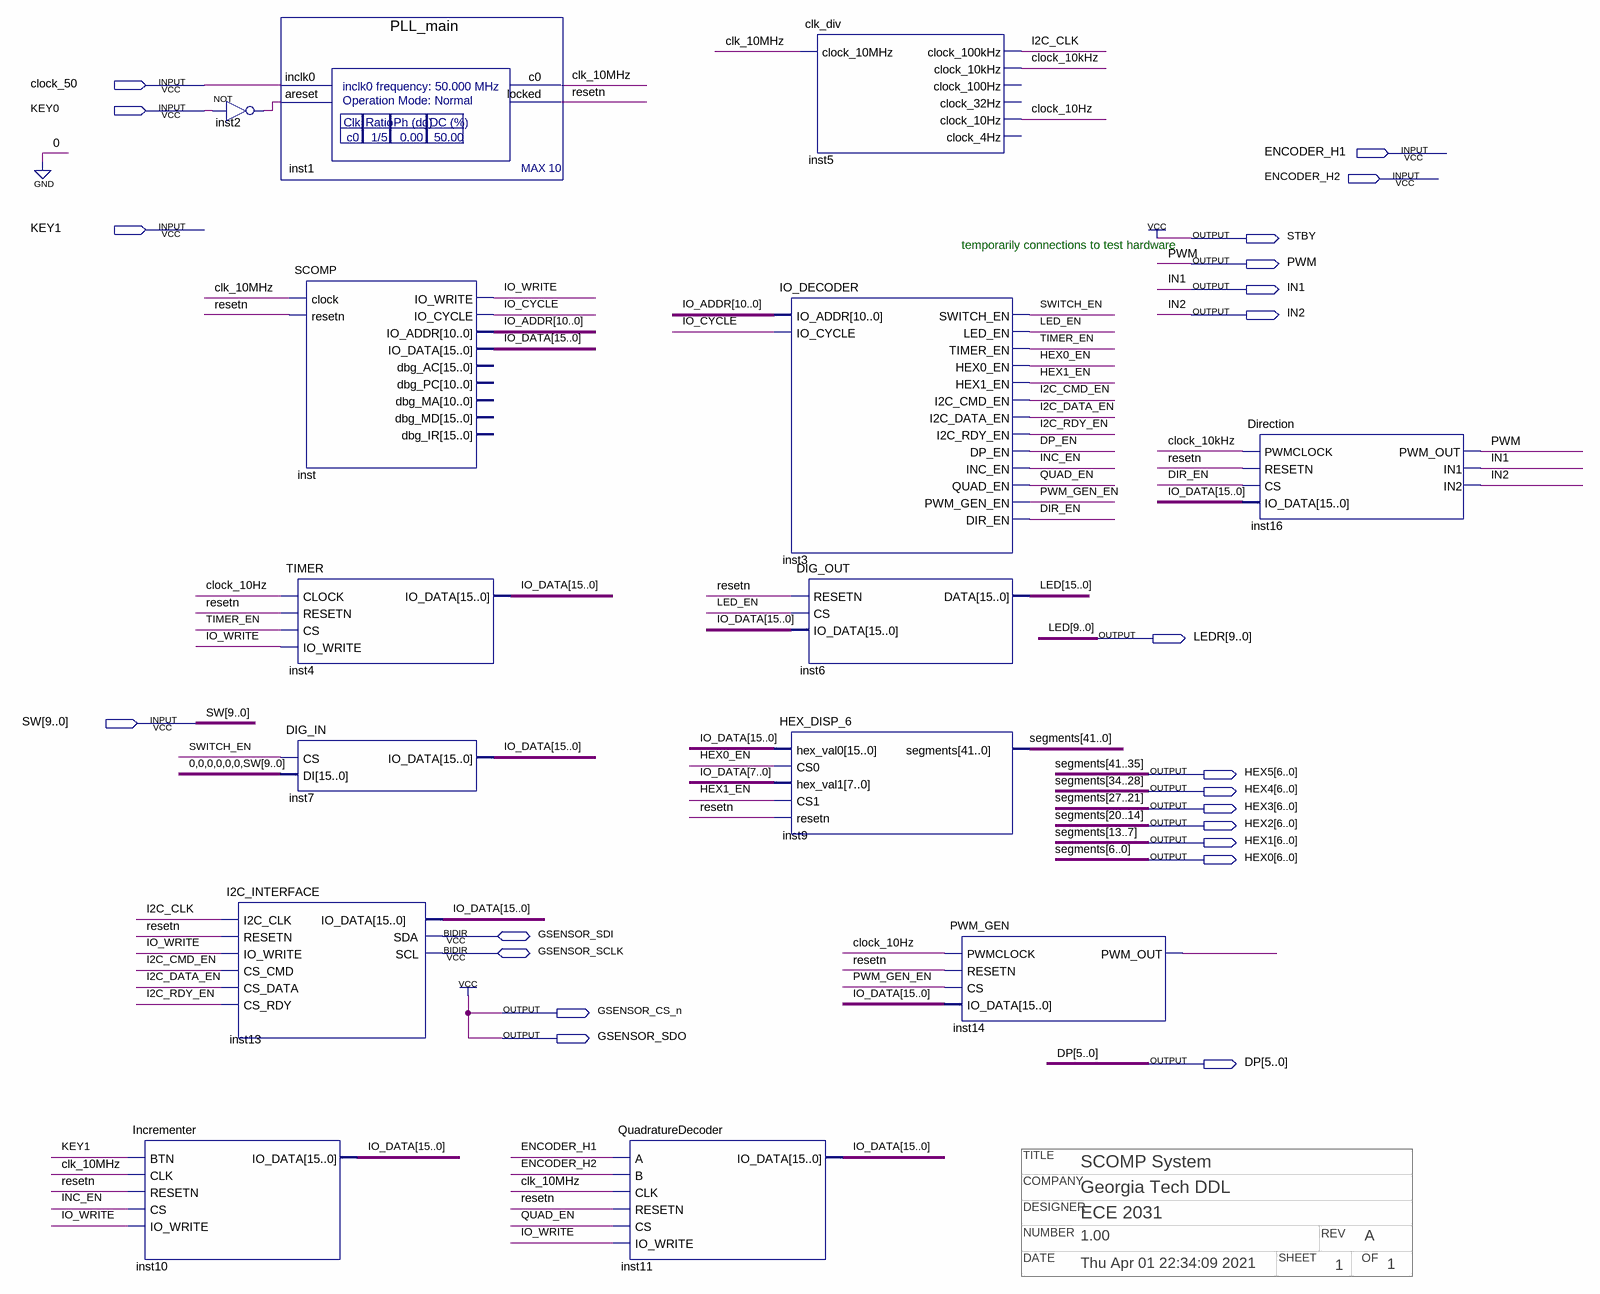
[diagram p0: schematic sheet]
// Quartus schematic SCOMP_System.bdf as structural Verilog: 14 symbols, 22 pins
// Title block: COMPANY: Georgia Tech DDL; DATE: Thu Apr 01 22:34:09 2021; DESIGNER: ECE 2031; NUMBER: 1.00; OF: 1; REV: A; SHEET: 1; TITLE: SCOMP System
module SCOMP_System (
  input  clock_50,
  input  KEY0,
  input  ENCODER_H1,
  input  ENCODER_H2,
  input  KEY1,
  input  [9:0] SW,
  inout  GSENSOR_SDI,
  inout  GSENSOR_SCLK,
  output STBY,
  output PWM,
  output IN1,
  output IN2,
  output [9:0] LEDR,
  output [6:0] HEX5,
  output [6:0] HEX4,
  output [6:0] HEX3,
  output [6:0] HEX2,
  output [6:0] HEX1,
  output [6:0] HEX0,
  output GSENSOR_CS_n,
  output GSENSOR_SDO,
  output [5:0] DP
);

  wire clk_10MHz, clock_10Hz, clock_10kHz, DIR_EN, DP_EN, HEX0_EN, HEX1_EN, I2C_CLK, I2C_CMD_EN, I2C_DATA_EN,
       I2C_RDY_EN, INC_EN, inst2_out, inst14_pwm_out, IO_CYCLE, IO_WRITE, LED_EN, PWM_GEN_EN, QUAD_EN,
       resetn, SWITCH_EN, TIMER_EN;
  wire [10:0] IO_ADDR;
  wire [15:0] IO_DATA;
  wire [15:10] LED;

  Incrementer inst10 (
    .BTN(KEY1), .CLK(clk_10MHz), .RESETN(resetn), .CS(INC_EN), .IO_WRITE(IO_WRITE), .IO_DATA(IO_DATA));
  not inst2 (inst2_out, KEY0);
  PLL_main inst1 (.inclk0(clock_50), .areset(inst2_out), .c0(clk_10MHz), .locked(resetn));
  TIMER inst4 (.CLOCK(clock_10Hz), .RESETN(resetn), .CS(TIMER_EN), .IO_WRITE(IO_WRITE), .IO_DATA(IO_DATA));
  DIG_IN inst7 (.CS(SWITCH_EN), .DI({{6{1'b0}}, SW}), .IO_DATA(IO_DATA));
  I2C_INTERFACE inst13 (
    .I2C_CLK(I2C_CLK), .RESETN(resetn), .IO_WRITE(IO_WRITE), .CS_CMD(I2C_CMD_EN), .CS_DATA(I2C_DATA_EN),
    .CS_RDY(I2C_RDY_EN), .IO_DATA(IO_DATA), .SDA(GSENSOR_SDI), .SCL(GSENSOR_SCLK));
  SCOMP inst (
    .clock(clk_10MHz), .resetn(resetn), .IO_WRITE(IO_WRITE), .IO_CYCLE(IO_CYCLE), .IO_ADDR(IO_ADDR),
    .IO_DATA(IO_DATA));  // open: dbg_AC, dbg_PC, dbg_MA, dbg_MD, dbg_IR
  QuadratureDecoder inst11 (
    .A(ENCODER_H1), .B(ENCODER_H2), .CLK(clk_10MHz), .RESETN(resetn), .CS(QUAD_EN), .IO_WRITE(IO_WRITE),
    .IO_DATA(IO_DATA));
  clk_div inst5 (
    .clock_10MHz(clk_10MHz), .clock_100kHz(I2C_CLK), .clock_10kHz(clock_10kHz), .clock_10Hz(clock_10Hz));  // open: clock_100Hz, clock_32Hz, clock_4Hz
  IO_DECODER inst3 (
    .IO_ADDR(IO_ADDR), .IO_CYCLE(IO_CYCLE), .SWITCH_EN(SWITCH_EN), .LED_EN(LED_EN), .TIMER_EN(TIMER_EN),
    .HEX0_EN(HEX0_EN), .HEX1_EN(HEX1_EN), .I2C_CMD_EN(I2C_CMD_EN), .I2C_DATA_EN(I2C_DATA_EN),
    .I2C_RDY_EN(I2C_RDY_EN), .DP_EN(DP_EN), .INC_EN(INC_EN), .QUAD_EN(QUAD_EN), .PWM_GEN_EN(PWM_GEN_EN),
    .DIR_EN(DIR_EN));
  DIG_OUT inst6 (.RESETN(resetn), .CS(LED_EN), .IO_DATA(IO_DATA), .DATA({LED, LEDR}));
  HEX_DISP_6 inst9 (
    .hex_val0(IO_DATA), .CS0(HEX0_EN), .hex_val1(IO_DATA[7:0]), .CS1(HEX1_EN), .resetn(resetn),
    .segments({HEX5, HEX4, HEX3, HEX2, HEX1, HEX0}));
  PWM_GEN inst14 (.PWMCLOCK(clock_10Hz), .RESETN(resetn), .CS(PWM_GEN_EN), .IO_DATA(IO_DATA), .PWM_OUT(inst14_pwm_out));
  Direction inst16 (
    .PWMCLOCK(clock_10kHz), .RESETN(resetn), .CS(DIR_EN), .IO_DATA(IO_DATA), .PWM_OUT(PWM), .IN1(IN1),
    .IN2(IN2));

  assign GSENSOR_CS_n = 1'b1;
  assign GSENSOR_SDO = 1'b1;
  assign STBY = 1'b1;

  // Other names for the same wires on the sheet: LED[9:0] = LEDR;
  //   segments[41:0] = {HEX5, HEX4, HEX3, HEX2, HEX1, HEX0}

  // Notes on the sheet:
  //   temporarily connections to test hardware
endmodule
